# Altium project novena_pvt2.PrjPcb (part 4 of 4)

## Sheet 15fpga.SchDoc
size C
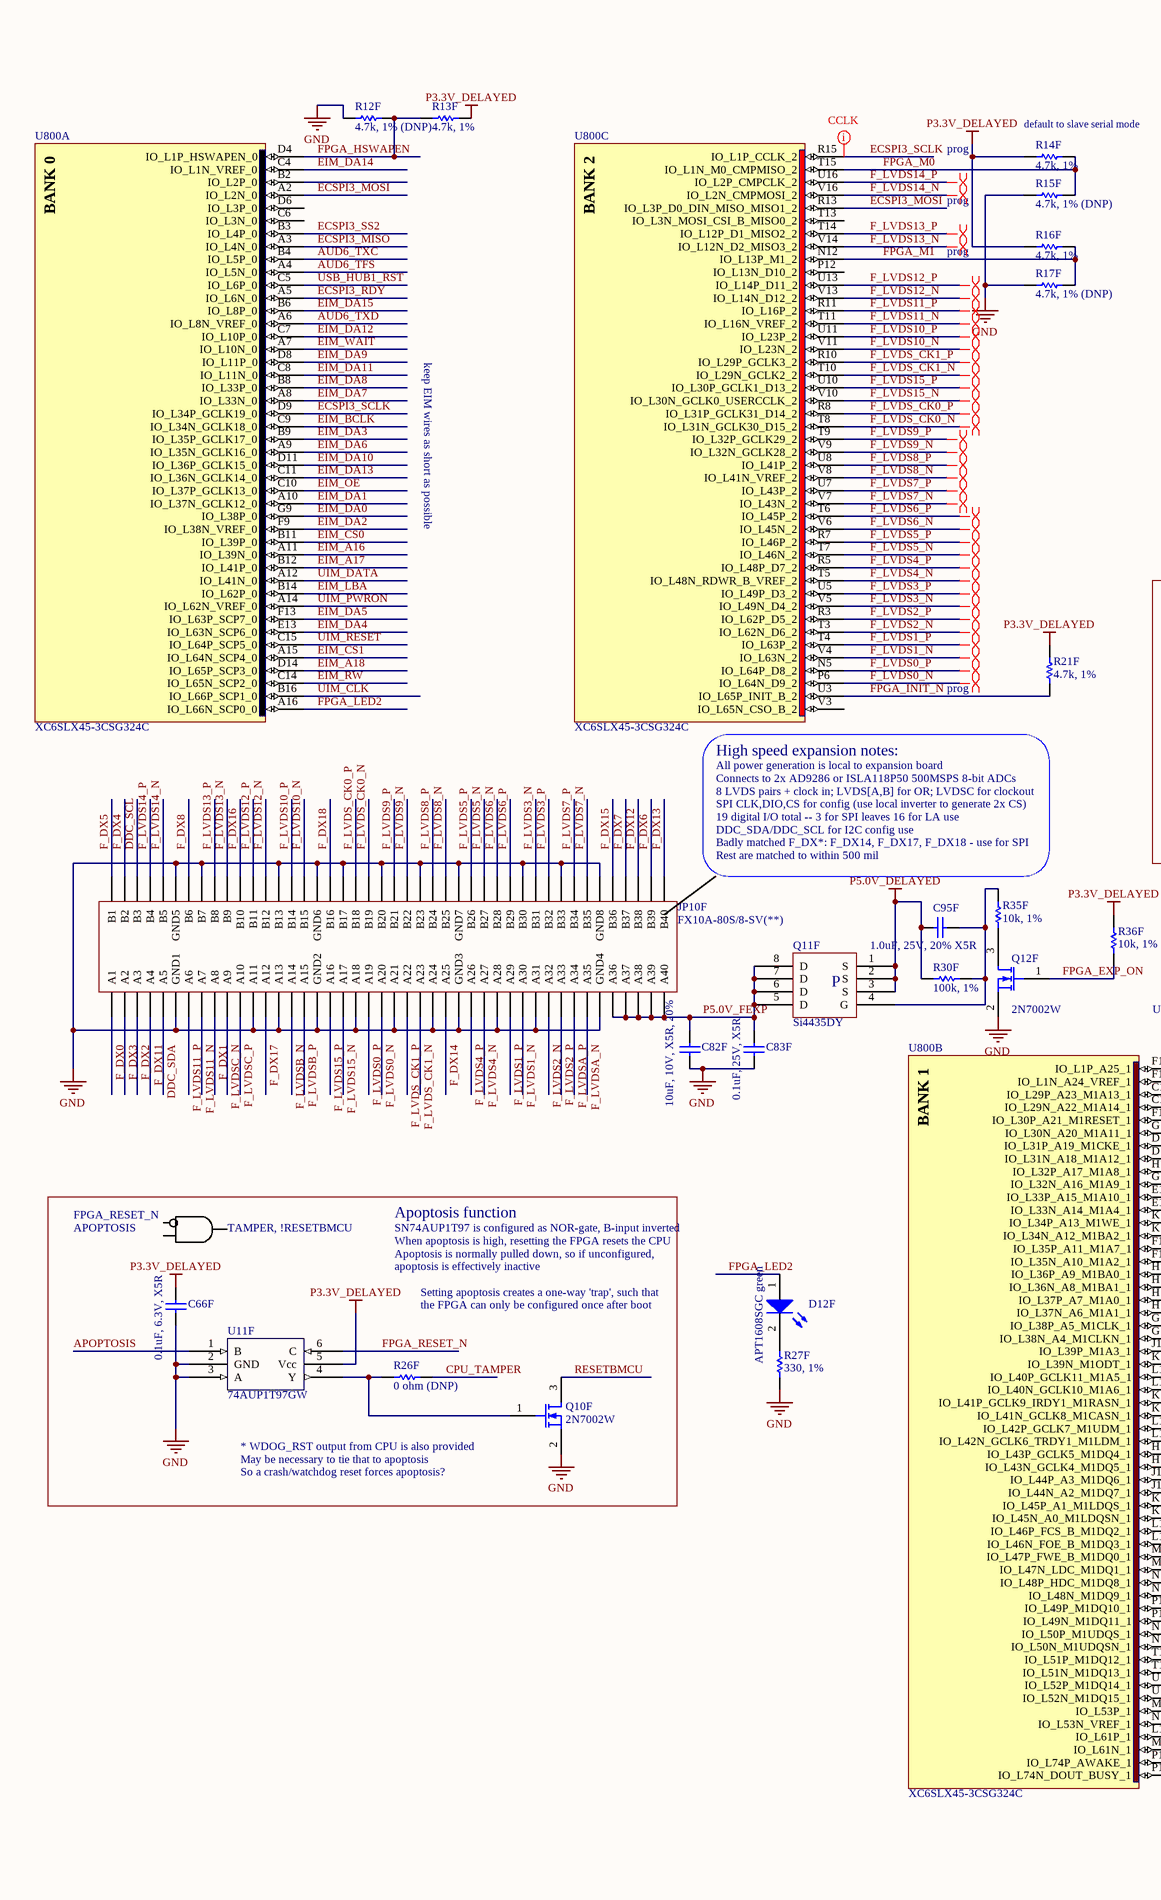
[diagram p16: 15fpga.SchDoc, left]
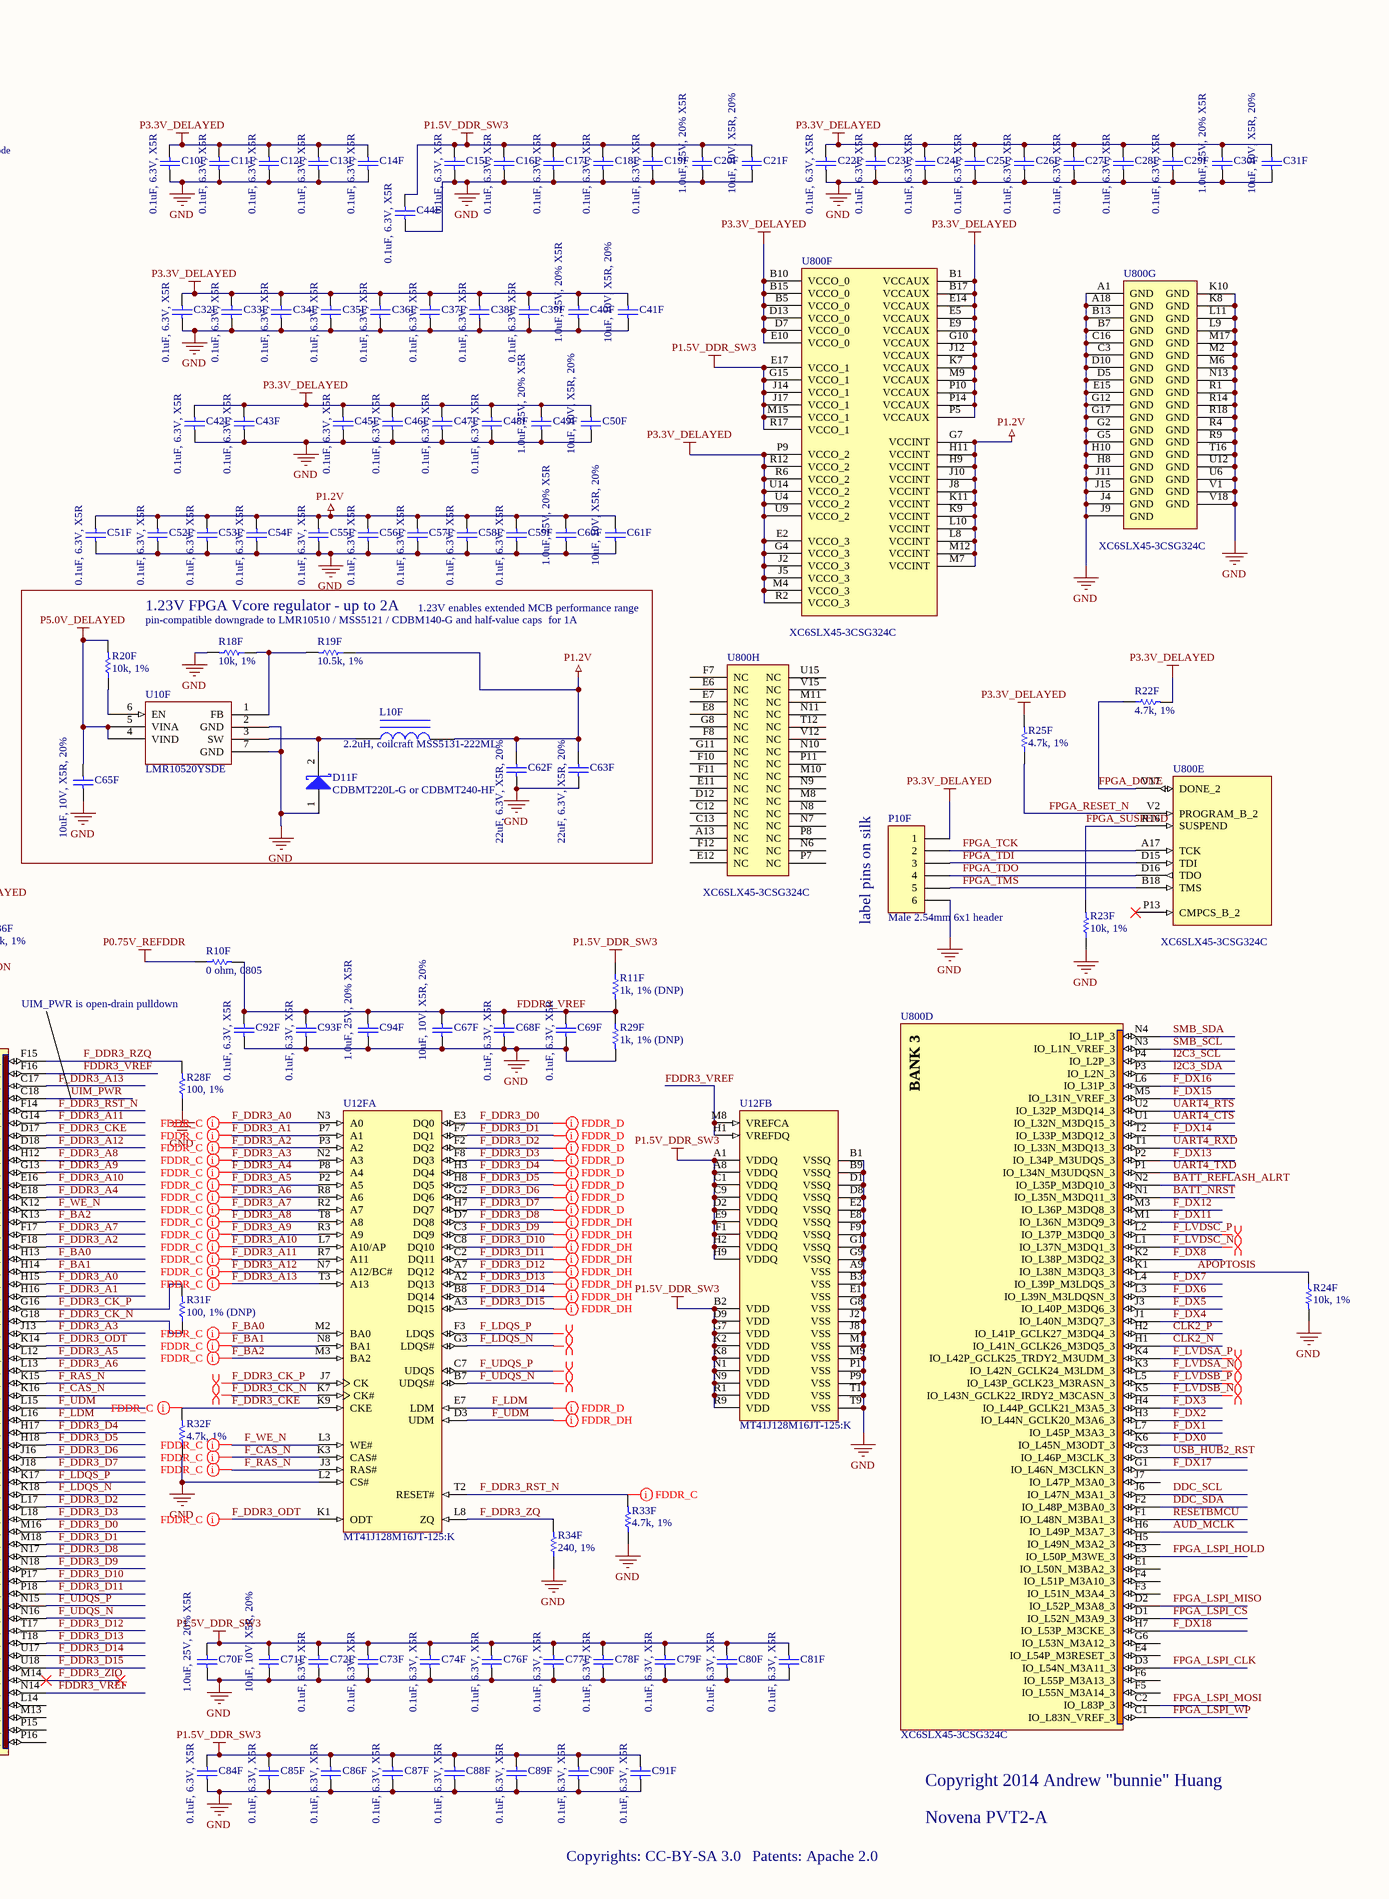
[diagram p17: 15fpga.SchDoc, right]

### Parts
C10F  0.1uF, 6.3V, X5R  [CAPC0603N_B]
C11F  0.1uF, 6.3V, X5R  [CAPC0603N_B]
C12F  0.1uF, 6.3V, X5R  [CAPC0603N_B]
C13F  0.1uF, 6.3V, X5R  [CAPC0603N_B]
C14F  0.1uF, 6.3V, X5R  [CAPC0603N_B]
C15F  0.1uF, 6.3V, X5R  [CAPC0603N_B]
C16F  0.1uF, 6.3V, X5R  [CAPC0603N_B]
C17F  0.1uF, 6.3V, X5R  [CAPC0603N_B]
C18F  0.1uF, 6.3V, X5R  [CAPC0603N_B]
C19F  0.1uF, 6.3V, X5R  [CAPC0603N_B]
C20F  1.0uF, 25V, 20% X5R  [CAPC1608N]
C21F  10uF, 10V, X5R, 20%  [CAPC1608N]
C22F  0.1uF, 6.3V, X5R  [CAPC0603N_B]
C23F  0.1uF, 6.3V, X5R  [CAPC0603N_B]
C24F  0.1uF, 6.3V, X5R  [CAPC0603N_B]
C25F  0.1uF, 6.3V, X5R  [CAPC0603N_B]
C26F  0.1uF, 6.3V, X5R  [CAPC0603N_B]
C27F  0.1uF, 6.3V, X5R  [CAPC0603N_B]
C28F  0.1uF, 6.3V, X5R  [CAPC0603N_B]
C29F  0.1uF, 6.3V, X5R  [CAPC0603N_B]
C30F  1.0uF, 25V, 20% X5R  [CAPC1608N]
C31F  10uF, 10V, X5R, 20%  [CAPC1608N]
C32F  0.1uF, 6.3V, X5R  [CAPC0603N_B]
C33F  0.1uF, 6.3V, X5R  [CAPC0603N_B]
C34F  0.1uF, 6.3V, X5R  [CAPC0603N_B]
C35F  0.1uF, 6.3V, X5R  [CAPC0603N_B]
C36F  0.1uF, 6.3V, X5R  [CAPC0603N_B]
C37F  0.1uF, 6.3V, X5R  [CAPC0603N_B]
C38F  0.1uF, 6.3V, X5R  [CAPC0603N_B]
C39F  0.1uF, 6.3V, X5R  [CAPC0603N_B]
C40F  1.0uF, 25V, 20% X5R  [CAPC1608N]
C41F  10uF, 10V, X5R, 20%  [CAPC1608N]
C42F  0.1uF, 6.3V, X5R  [CAPC0603N_B]
C43F  0.1uF, 6.3V, X5R  [CAPC0603N_B]
C44F  0.1uF, 6.3V, X5R  [CAPC0603N_B]
C45F  0.1uF, 6.3V, X5R  [CAPC0603N_B]
C46F  0.1uF, 6.3V, X5R  [CAPC0603N_B]
C47F  0.1uF, 6.3V, X5R  [CAPC0603N_B]
C48F  0.1uF, 6.3V, X5R  [CAPC0603N_B]
C49F  1.0uF, 25V, 20% X5R  [CAPC1608N]
C50F  10uF, 10V, X5R, 20%  [CAPC1608N]
C51F  0.1uF, 6.3V, X5R  [CAPC0603N_B]
C52F  0.1uF, 6.3V, X5R  [CAPC0603N_B]
C53F  0.1uF, 6.3V, X5R  [CAPC0603N_B]
C54F  0.1uF, 6.3V, X5R  [CAPC0603N_B]
C55F  0.1uF, 6.3V, X5R  [CAPC0603N_B]
C56F  0.1uF, 6.3V, X5R  [CAPC0603N_B]
C57F  0.1uF, 6.3V, X5R  [CAPC0603N_B]
C58F  0.1uF, 6.3V, X5R  [CAPC0603N_B]
C59F  0.1uF, 6.3V, X5R  [CAPC0603N_B]
C60F  1.0uF, 25V, 20% X5R  [CAPC1608N]
C61F  10uF, 10V, X5R, 20%  [CAPC1608N]
C62F  22uF, 6.3V, X5R, 20%  [CAPC1608N_HD]
C63F  22uF, 6.3V, X5R, 20%  [CAPC1608N_HD]
C65F  10uF, 10V, X5R, 20%  [CAPC1608N]
C66F  0.1uF, 6.3V, X5R  [CAPC0603N_B]
C67F  10uF, 10V, X5R, 20%  [CAPC1608N]
C68F  0.1uF, 6.3V, X5R  [CAPC0603N_B]
C69F  0.1uF, 6.3V, X5R  [CAPC0603N_B]
C70F  1.0uF, 25V, 20% X5R  [CAPC1608N]
C71F  10uF, 10V, X5R, 20%  [CAPC1608N]
C72F  0.1uF, 6.3V, X5R  [CAPC0603N_B]
C73F  0.1uF, 6.3V, X5R  [CAPC0603N_B]
C74F  0.1uF, 6.3V, X5R  [CAPC0603N_B]
C76F  0.1uF, 6.3V, X5R  [CAPC0603N_B]
C77F  0.1uF, 6.3V, X5R  [CAPC0603N_B]
C78F  0.1uF, 6.3V, X5R  [CAPC0603N_B]
C79F  0.1uF, 6.3V, X5R  [CAPC0603N_B]
C80F  0.1uF, 6.3V, X5R  [CAPC0603N_B]
C81F  0.1uF, 6.3V, X5R  [CAPC0603N_B]
C82F  10uF, 10V, X5R, 20%  [CAPC1608N]
C83F  0.1uF, 25V, X5R  [CAPC1005N]
C84F  0.1uF, 6.3V, X5R  [CAPC0603N_B]
C85F  0.1uF, 6.3V, X5R  [CAPC0603N_B]
C86F  0.1uF, 6.3V, X5R  [CAPC0603N_B]
C87F  0.1uF, 6.3V, X5R  [CAPC0603N_B]
C88F  0.1uF, 6.3V, X5R  [CAPC0603N_B]
C89F  0.1uF, 6.3V, X5R  [CAPC0603N_B]
C90F  0.1uF, 6.3V, X5R  [CAPC0603N_B]
C91F  0.1uF, 6.3V, X5R  [CAPC0603N_B]
C92F  0.1uF, 6.3V, X5R  [CAPC0603N_B]
C93F  0.1uF, 6.3V, X5R  [CAPC0603N_B]
C94F  1.0uF, 25V, 20% X5R  [CAPC1608N]
C95F  1.0uF, 25V, 20% X5R  [CAPC1608N]
D11F  CDBMT220L-G or CDBMT240-HF  [SOD123]
D12F  APT1608SGC green  [CD1608-0603]
JP10F  FX10A-80S/8-SV(**)  [HRS_FX10A-80S/8-SV1(**)]
L10F  2.2uH, coilcraft MSS5131-222ML  [COILCRAFT_MSS5121]
P10F  Male 2.54mm 6x1 header  [HDR1X6]
Q10F  2N7002W  [SOT323-3AN]
Q11F  Si4435DY  [SOIC127P600-8AN]
Q12F  2N7002W  [SOT323-3AN]
R10F  0 ohm, 0805  [RESC2012N]
R11F  1k, 1% (DNP)  [RESC1005N]
R12F  4.7k, 1% (DNP)  [RESC1005N]
R13F  4.7k, 1%  [RESC1005N]
R14F  4.7k, 1%  [RESC1005N]
R15F  4.7k, 1% (DNP)  [RESC1005N]
R16F  4.7k, 1%  [RESC1005N]
R17F  4.7k, 1% (DNP)  [RESC1005N]
R18F  10k, 1%  [RESC1005N]
R19F  10.5k, 1%  [RESC1005N]
R20F  10k, 1%  [RESC1005N]
R21F  4.7k, 1%  [RESC1005N]
R22F  4.7k, 1%  [RESC1005N]
R23F  10k, 1%  [RESC1005N]
R24F  10k, 1%  [RESC1005N]
R25F  4.7k, 1%  [RESC1005N]
R26F  0 ohm (DNP)  [RESC1005N]
R27F  330, 1%  [RESC1005N]
R28F  100, 1%  [RESC1005N]
R29F  1k, 1% (DNP)  [RESC1005N]
R30F  100k, 1%  [RESC1005N]
R31F  100, 1% (DNP)  [RESC1005N]
R32F  4.7k, 1%  [RESC1005N]
R33F  4.7k, 1%  [RESC1005N]
R34F  240, 1%  [RESC1005N]
R35F  10k, 1%  [RESC1005N]
R36F  10k, 1%  [RESC1005N]
U10F  LMR10520YSDE  [SON95P300X300X80-7V]
U11F  74AUP1T97GW  [SOT363-6N]
U12F  MT41J128M16JT-125:K  [MICT-HA-96]  (parts A,B of 3)
U800  XC6SLX45-3CSG324C  [CSG324]  (parts A,B,C,D,E,F,G,H of 8)

### Blocks framed on the sheet
1.23V FPGA Vcore regulator - up to 2A: C62F C63F C65F D11F L10F R18F R19F R20F U10F
Apoptosis function: C66F Q10F R26F U11F

### Nets
GND: C10F.2 C11F.2 C12F.2 C13F.2 C14F.2 C15F.2 C16F.2 C17F.2 C18F.2 C19F.2 C20F.1 C21F.2 C22F.2 C23F.2 C24F.2 C25F.2 C26F.2 C27F.2 C28F.2 C29F.2 C30F.1 C31F.2 C32F.2 C33F.2 C34F.2 C35F.2 C36F.2 C37F.2 C38F.2 C39F.2 C40F.1 C41F.2 C42F.2 C43F.2 C44F.2 C45F.2 C46F.2 C47F.2 C48F.2 C49F.1 C50F.2 C51F.2 C52F.2 C53F.2 C54F.2 C55F.2 C56F.2 C57F.2 C58F.2 C59F.2 C60F.1 C61F.2 C62F.2 C63F.2 C65F.1 C66F.2 C67F.2 C68F.2 C69F.2 C70F.1 C71F.2 C72F.2 C73F.2 C74F.2 C76F.2 C77F.2 C78F.2 C79F.2 C80F.2 C81F.2 C82F.1 C83F.2 C84F.2 C85F.2 C86F.2 C87F.2 C88F.2 C89F.2 C90F.2 C91F.2 C92F.2 C93F.2 C94F.1 D11F.1(A) JP10F.A11 JP10F.A13 JP10F.A18 JP10F.A21 JP10F.A24 JP10F.A28 JP10F.A31 JP10F.B7 JP10F.B13 JP10F.B17 JP10F.B20 JP10F.B23 JP10F.B30 JP10F.B33 JP10F.GND1 JP10F.GND2 JP10F.GND3 JP10F.GND4 JP10F.GND5 JP10F.GND6 JP10F.GND7 JP10F.GND8 P10F.6 Q10F.2(S) Q12F.2(S) R12F.1 R15F.1 R17F.1 R18F.2 R23F.1 R24F.2 R27F.1 R28F.1 R29F.2 R32F.1 R33F.1 R34F.1 U10F.2(GND) U10F.7(GND) U11F.2(GND) U11F.3(A) U12F.A9(VSS) U12F.B1(VSSQ) U12F.B3(VSS) U12F.B9(VSSQ) U12F.D1(VSSQ) U12F.D8(VSSQ) U12F.E1(VSS) U12F.E2(VSSQ) U12F.E8(VSSQ) U12F.F9(VSSQ) U12F.G1(VSSQ) U12F.G8(VSS) U12F.G9(VSSQ) U12F.J2(VSS) U12F.J8(VSS) U12F.L2(CS#) U12F.M1(VSS) U12F.M9(VSS) U12F.P1(VSS) U12F.P9(VSS) U12F.T1(VSS) U12F.T9(VSS) U800.A1(GND) U800.A18(GND) U800.B7(GND) U800.B13(GND) U800.C3(GND) U800.C16(GND) U800.D5(GND) U800.D10(GND) U800.E15(GND) U800.G2(GND) U800.G5(GND) U800.G12(GND) U800.G17(GND) U800.H8(GND) U800.H10(GND) U800.J4(GND) U800.J9(GND) U800.J11(GND) U800.J15(GND) U800.K8(GND) U800.K10(GND) U800.L9(GND) U800.L11(GND) U800.M2(GND) U800.M6(GND) U800.M17(GND) U800.N13(GND) U800.R1(GND) U800.R4(GND) U800.R9(GND) U800.R14(GND) U800.R18(GND) U800.T16(GND) U800.U6(GND) U800.U12(GND) U800.V1(GND) U800.V18(GND)
P0.75V_REFDDR: R10F.1
P1.2V: C51F.1 C52F.1 C53F.1 C54F.1 C55F.1 C56F.1 C57F.1 C58F.1 C59F.1 C60F.2 C61F.1 C62F.1 C63F.1 L10F.2 R19F.1 U800.G7(VCCINT) U800.H9(VCCINT) U800.H11(VCCINT) U800.J8(VCCINT) U800.J10(VCCINT) U800.K9(VCCINT) U800.K11(VCCINT) U800.L8(VCCINT) U800.L10(VCCINT) U800.M7(VCCINT) U800.M12(VCCINT)
P1.5V_DDR_SW3: C15F.1 C16F.1 C17F.1 C18F.1 C19F.1 C20F.2 C21F.1 C44F.1 C70F.2 C71F.1 C72F.1 C73F.1 C74F.1 C76F.1 C77F.1 C78F.1 C79F.1 C80F.1 C81F.1 C84F.1 C85F.1 C86F.1 C87F.1 C88F.1 C89F.1 C90F.1 C91F.1 R11F.1 U12F.A1(VDDQ) U12F.A8(VDDQ) U12F.B2(VDD) U12F.C1(VDDQ) U12F.C9(VDDQ) U12F.D2(VDDQ) U12F.D9(VDD) U12F.E9(VDDQ) U12F.F1(VDDQ) U12F.G7(VDD) U12F.H2(VDDQ) U12F.H9(VDDQ) U12F.K2(VDD) U12F.K8(VDD) U12F.N1(VDD) U12F.N9(VDD) U12F.R1(VDD) U12F.R9(VDD) U800.E17(VCCO_1) U800.G15(VCCO_1) U800.J14(VCCO_1) U800.J17(VCCO_1) U800.M15(VCCO_1) U800.R17(VCCO_1)
P3.3V_DELAYED: C10F.1 C11F.1 C12F.1 C13F.1 C14F.1 C22F.1 C23F.1 C24F.1 C25F.1 C26F.1 C27F.1 C28F.1 C29F.1 C30F.2 C31F.1 C32F.1 C33F.1 C34F.1 C35F.1 C36F.1 C37F.1 C38F.1 C39F.1 C40F.2 C41F.1 C42F.1 C43F.1 C45F.1 C46F.1 C47F.1 C48F.1 C49F.2 C50F.1 C66F.1 P10F.1 R13F.2 R14F.1 R16F.1 R21F.1 R22F.2 R25F.2 R36F.1 U11F.5(Vcc) U800.B1(VCCAUX) U800.B5(VCCO_0) U800.B10(VCCO_0) U800.B15(VCCO_0) U800.B17(VCCAUX) U800.D7(VCCO_0) U800.D13(VCCO_0) U800.E2(VCCO_3) U800.E5(VCCAUX) U800.E9(VCCAUX) U800.E10(VCCO_0) U800.E14(VCCAUX) U800.G4(VCCO_3) U800.G10(VCCAUX) U800.J2(VCCO_3) U800.J5(VCCO_3) U800.J12(VCCAUX) U800.K7(VCCAUX) U800.M4(VCCO_3) U800.M9(VCCAUX) U800.P5(VCCAUX) U800.P9(VCCO_2) U800.P10(VCCAUX) U800.P14(VCCAUX) U800.R2(VCCO_3) U800.R6(VCCO_2) U800.R12(VCCO_2) U800.U4(VCCO_2) U800.U9(VCCO_2) U800.U14(VCCO_2)
P5.0V_DELAYED: C65F.2 C95F.1 Q11F.1(S) Q11F.2(S) Q11F.3(S) R20F.2 R30F.2 U10F.4(VIND) U10F.5(VINA)
APOPTOSIS: R24F.1 U11F.1(B) U800.K1(IO_L38N_M3DQ3_3)
AUD6_TFS: U800.A4(IO_L5N_0)
AUD6_TXC: U800.B4(IO_L5P_0)
AUD6_TXD: U800.A6(IO_L8N_VREF_0)
AUD_MCLK: U800.H6(IO_L49P_M3A7_3)
BATT_NRST: U800.N1(IO_L35N_M3DQ11_3)
BATT_REFLASH_ALRT: U800.N2(IO_L35P_M3DQ10_3)
CLK2_N: U800.H1(IO_L41N_GCLK26_M3DQ5_3)
CLK2_P: U800.H2(IO_L41P_GCLK27_M3DQ4_3)
CPU_TAMPER: R26F.2
DDC_SCL: JP10F.B3 U800.J6(IO_L47N_M3A1_3)
DDC_SDA: JP10F.A5 U800.F2(IO_L48P_M3BA0_3)
ECSPI3_MISO: U800.A3(IO_L4N_0)
ECSPI3_MOSI: U800.A2(IO_L2N_0) U800.R13(IO_L3P_D0_DIN_MISO_MISO1_2)
ECSPI3_RDY: U800.A5(IO_L6N_0)
ECSPI3_SCLK: U800.D9(IO_L34P_GCLK19_0) U800.R15(IO_L1P_CCLK_2)
ECSPI3_SS2: U800.B3(IO_L4P_0)
EIM_A16: U800.A11(IO_L39N_0)
EIM_A17: U800.B12(IO_L41P_0)
EIM_A18: U800.D14(IO_L65P_SCP3_0)
EIM_BCLK: U800.C9(IO_L34N_GCLK18_0)
EIM_CS0: U800.B11(IO_L39P_0)
EIM_CS1: U800.A15(IO_L64N_SCP4_0)
EIM_DA0: U800.G9(IO_L38P_0)
EIM_DA1: U800.A10(IO_L37N_GCLK12_0)
EIM_DA2: U800.F9(IO_L38N_VREF_0)
EIM_DA3: U800.B9(IO_L35P_GCLK17_0)
EIM_DA4: U800.E13(IO_L63N_SCP6_0)
EIM_DA5: U800.F13(IO_L63P_SCP7_0)
EIM_DA6: U800.A9(IO_L35N_GCLK16_0)
EIM_DA7: U800.A8(IO_L33N_0)
EIM_DA8: U800.B8(IO_L33P_0)
EIM_DA9: U800.D8(IO_L11P_0)
EIM_DA10: U800.D11(IO_L36P_GCLK15_0)
EIM_DA11: U800.C8(IO_L11N_0)
EIM_DA12: U800.C7(IO_L10P_0)
EIM_DA13: U800.C11(IO_L36N_GCLK14_0)
EIM_DA14: U800.C4(IO_L1N_VREF_0)
EIM_DA15: U800.B6(IO_L8P_0)
EIM_LBA: U800.B14(IO_L62P_0)
EIM_OE: U800.C10(IO_L37P_GCLK13_0)
EIM_RW: U800.C14(IO_L65N_SCP2_0)
EIM_WAIT: U800.A7(IO_L10N_0)
F_BA0: U12F.M2(BA0) U800.H13(IO_L36P_A9_M1BA0_1)
F_BA1: U12F.N8(BA1) U800.H14(IO_L36N_A8_M1BA1_1)
F_BA2: U12F.M3(BA2) U800.K13(IO_L34N_A12_M1BA2_1)
F_CAS_N: U12F.K3(CAS#) U800.K16(IO_L41N_GCLK8_M1CASN_1)
F_DDR3_A0: U12F.N3(A0) U800.H15(IO_L37P_A7_M1A0_1)
F_DDR3_A1: U12F.P7(A1) U800.H16(IO_L37N_A6_M1A1_1)
F_DDR3_A2: U12F.P3(A2) U800.F18(IO_L35N_A10_M1A2_1)
F_DDR3_A3: U12F.N2(A3) U800.J13(IO_L39P_M1A3_1)
F_DDR3_A4: U12F.P8(A4) U800.E18(IO_L33N_A14_M1A4_1)
F_DDR3_A5: U12F.P2(A5) U800.L12(IO_L40P_GCLK11_M1A5_1)
F_DDR3_A6: U12F.R8(A6) U800.L13(IO_L40N_GCLK10_M1A6_1)
F_DDR3_A7: U12F.R2(A7) U800.F17(IO_L35P_A11_M1A7_1)
F_DDR3_A8: U12F.T8(A8) U800.H12(IO_L32P_A17_M1A8_1)
F_DDR3_A9: U12F.R3(A9) U800.G13(IO_L32N_A16_M1A9_1)
F_DDR3_A10: U12F.L7(A10/AP) U800.E16(IO_L33P_A15_M1A10_1)
F_DDR3_A11: U12F.R7(A11) U800.G14(IO_L30N_A20_M1A11_1)
F_DDR3_A12: U12F.N7(A12/BC#) U800.D18(IO_L31N_A18_M1A12_1)
F_DDR3_A13: U12F.T3(A13) U800.C17(IO_L29P_A23_M1A13_1)
F_DDR3_CK_N: R31F.1 U12F.K7(CK#) U800.G18(IO_L38N_A4_M1CLKN_1)
F_DDR3_CK_P: R31F.2 U12F.J7(CK) U800.G16(IO_L38P_A5_M1CLK_1)
F_DDR3_CKE: R32F.2 U12F.K9(CKE) U800.D17(IO_L31P_A19_M1CKE_1)
F_DDR3_D0: U12F.E3(DQ0) U800.M16(IO_L47P_FWE_B_M1DQ0_1)
F_DDR3_D1: U12F.F7(DQ1) U800.M18(IO_L47N_LDC_M1DQ1_1)
F_DDR3_D2: U12F.F2(DQ2) U800.L17(IO_L46P_FCS_B_M1DQ2_1)
F_DDR3_D3: U12F.F8(DQ3) U800.L18(IO_L46N_FOE_B_M1DQ3_1)
F_DDR3_D4: U12F.H3(DQ4) U800.H17(IO_L43P_GCLK5_M1DQ4_1)
F_DDR3_D5: U12F.H8(DQ5) U800.H18(IO_L43N_GCLK4_M1DQ5_1)
F_DDR3_D6: U12F.G2(DQ6) U800.J16(IO_L44P_A3_M1DQ6_1)
F_DDR3_D7: U12F.H7(DQ7) U800.J18(IO_L44N_A2_M1DQ7_1)
F_DDR3_D8: U12F.D7(DQ8) U800.N17(IO_L48P_HDC_M1DQ8_1)
F_DDR3_D9: U12F.C3(DQ9) U800.N18(IO_L48N_M1DQ9_1)
F_DDR3_D10: U12F.C8(DQ10) U800.P17(IO_L49P_M1DQ10_1)
F_DDR3_D11: U12F.C2(DQ11) U800.P18(IO_L49N_M1DQ11_1)
F_DDR3_D12: U12F.A7(DQ12) U800.T17(IO_L51P_M1DQ12_1)
F_DDR3_D13: U12F.A2(DQ13) U800.T18(IO_L51N_M1DQ13_1)
F_DDR3_D14: U12F.B8(DQ14) U800.U17(IO_L52P_M1DQ14_1)
F_DDR3_D15: U12F.A3(DQ15) U800.U18(IO_L52N_M1DQ15_1)
F_DDR3_ODT: U12F.K1(ODT) U800.K14(IO_L39N_M1ODT_1)
F_DDR3_RST_N: R33F.2 U12F.T2(RESET#) U800.F14(IO_L30P_A21_M1RESET_1)
F_DDR3_RZQ: R28F.2 U800.F15(IO_L1P_A25_1)
F_DDR3_ZIO: U800.M14(IO_L53P_1)
F_DDR3_ZQ: R34F.2 U12F.L8(ZQ)
F_DX0: JP10F.A1 U800.K6(IO_L45N_M3ODT_3)
F_DX1: JP10F.A8 U800.L7(IO_L45P_M3A3_3)
F_DX2: JP10F.A3 U800.H3(IO_L44N_GCLK20_M3A6_3)
F_DX3: JP10F.A2 U800.H4(IO_L44P_GCLK21_M3A5_3)
F_DX4: JP10F.B2 U800.J1(IO_L40N_M3DQ7_3)
F_DX5: JP10F.B1 U800.J3(IO_L40P_M3DQ6_3)
F_DX6: JP10F.B39 U800.L3(IO_L39N_M3LDQSN_3)
F_DX7: JP10F.B37 U800.L4(IO_L39P_M3LDQS_3)
F_DX8: JP10F.B6 U800.K2(IO_L38P_M3DQ2_3)
F_DX11: JP10F.A4 U800.M1(IO_L36N_M3DQ9_3)
F_DX12: JP10F.B38 U800.M3(IO_L36P_M3DQ8_3)
F_DX13: JP10F.B40 U800.P2(IO_L34P_M3UDQS_3)
F_DX14: JP10F.A25 U800.T2(IO_L33P_M3DQ12_3)
F_DX15: JP10F.B36 U800.M5(IO_L31N_VREF_3)
F_DX16: JP10F.B10 U800.L6(IO_L31P_3)
F_DX17: JP10F.A12 U800.G1(IO_L46N_M3CLKN_3)
F_DX18: JP10F.B16 U800.H7(IO_L53P_M3CKE_3)
F_LDM: U12F.E7(LDM) U800.L16(IO_L42N_GCLK6_TRDY1_M1LDM_1)
F_LDQS_N: U12F.G3(LDQS#) U800.K18(IO_L45N_A0_M1LDQSN_1)
F_LDQS_P: U12F.F3(LDQS) U800.K17(IO_L45P_A1_M1LDQS_1)
F_LVDS0_N: JP10F.A20 U800.P6(IO_L64N_D9_2)
F_LVDS0_P: JP10F.A19 U800.N5(IO_L64P_D8_2)
F_LVDS1_N: JP10F.A30 U800.V4(IO_L63N_2)
F_LVDS1_P: JP10F.A29 U800.T4(IO_L63P_2)
F_LVDS2_N: JP10F.A32 U800.T3(IO_L62N_D6_2)
F_LVDS2_P: JP10F.A33 U800.R3(IO_L62P_D5_2)
F_LVDS3_N: JP10F.B31 U800.V5(IO_L49N_D4_2)
F_LVDS3_P: JP10F.B32 U800.U5(IO_L49P_D3_2)
F_LVDS4_N: JP10F.A27 U800.T5(IO_L48N_RDWR_B_VREF_2)
F_LVDS4_P: JP10F.A26 U800.R5(IO_L48P_D7_2)
F_LVDS5_N: JP10F.B27 U800.T7(IO_L46N_2)
F_LVDS5_P: JP10F.B26 U800.R7(IO_L46P_2)
F_LVDS6_N: JP10F.B28 U800.V6(IO_L45N_2)
F_LVDS6_P: JP10F.B29 U800.T6(IO_L45P_2)
F_LVDS7_N: JP10F.B35 U800.V7(IO_L43N_2)
F_LVDS7_P: JP10F.B34 U800.U7(IO_L43P_2)
F_LVDS8_N: JP10F.B25 U800.V8(IO_L41N_VREF_2)
F_LVDS8_P: JP10F.B24 U800.U8(IO_L41P_2)
F_LVDS9_N: JP10F.B22 U800.V9(IO_L32N_GCLK28_2)
F_LVDS9_P: JP10F.B21 U800.T9(IO_L32P_GCLK29_2)
F_LVDS10_N: JP10F.B15 U800.V11(IO_L23N_2)
F_LVDS10_P: JP10F.B14 U800.U11(IO_L23P_2)
F_LVDS11_N: JP10F.A7 U800.T11(IO_L16N_VREF_2)
F_LVDS11_P: JP10F.A6 U800.R11(IO_L16P_2)
F_LVDS12_N: JP10F.B12 U800.V13(IO_L14N_D12_2)
F_LVDS12_P: JP10F.B11 U800.U13(IO_L14P_D11_2)
F_LVDS13_N: JP10F.B9 U800.V14(IO_L12N_D2_MISO3_2)
F_LVDS13_P: JP10F.B8 U800.T14(IO_L12P_D1_MISO2_2)
F_LVDS14_N: JP10F.B5 U800.V16(IO_L2N_CMPMOSI_2)
F_LVDS14_P: JP10F.B4 U800.U16(IO_L2P_CMPCLK_2)
F_LVDS15_N: JP10F.A17 U800.V10(IO_L30N_GCLK0_USERCCLK_2)
F_LVDS15_P: JP10F.A16 U800.U10(IO_L30P_GCLK1_D13_2)
F_LVDS_CK0_N: JP10F.B19 U800.T8(IO_L31N_GCLK30_D15_2)
F_LVDS_CK0_P: JP10F.B18 U800.R8(IO_L31P_GCLK31_D14_2)
F_LVDS_CK1_N: JP10F.A23 U800.T10(IO_L29N_GCLK2_2)
F_LVDS_CK1_P: JP10F.A22 U800.R10(IO_L29P_GCLK3_2)
F_LVDSA_N: JP10F.A35 U800.K3(IO_L42N_GCLK24_M3LDM_3)
F_LVDSA_P: JP10F.A34 U800.K4(IO_L42P_GCLK25_TRDY2_M3UDM_3)
F_LVDSB_N: JP10F.A14 U800.K5(IO_L43N_GCLK22_IRDY2_M3CASN_3)
F_LVDSB_P: JP10F.A15 U800.L5(IO_L43P_GCLK23_M3RASN_3)
F_LVDSC_N: JP10F.A9 U800.L1(IO_L37N_M3DQ1_3)
F_LVDSC_P: JP10F.A10 U800.L2(IO_L37P_M3DQ0_3)
F_RAS_N: U12F.J3(RAS#) U800.K15(IO_L41P_GCLK9_IRDY1_M1RASN_1)
F_UDM: U12F.D3(UDM) U800.L15(IO_L42P_GCLK7_M1UDM_1)
F_UDQS_N: U12F.B7(UDQS#) U800.N16(IO_L50N_M1UDQSN_1)
F_UDQS_P: U12F.C7(UDQS) U800.N15(IO_L50P_M1UDQS_1)
F_WE_N: U12F.L3(WE#) U800.K12(IO_L34P_A13_M1WE_1)
FDDR3_VREF: C67F.1 C68F.1 C69F.1 C92F.1 C93F.1 C94F.2 R10F.2 R11F.2 R29F.1 U12F.H1(VREFDQ) U12F.M8(VREFCA) U800.F16(IO_L1N_A24_VREF_1) U800.N14(IO_L53N_VREF_1)
FPGA_DONE: R22F.1 U800.V17(DONE_2)
FPGA_EXP_ON: Q12F.1(G) R36F.2
FPGA_HSWAPEN: R12F.2 R13F.1 U800.D4(IO_L1P_HSWAPEN_0)
FPGA_INIT_N: R21F.2 U800.U3(IO_L65P_INIT_B_2)
FPGA_LED2: D12F.1(A) U800.A16(IO_L66N_SCP0_0)
FPGA_LSPI_CLK: U800.D3(IO_L54N_M3A11_3)
FPGA_LSPI_CS: U800.D1(IO_L52N_M3A9_3)
FPGA_LSPI_HOLD: U800.E3(IO_L50P_M3WE_3)
FPGA_LSPI_MISO: U800.D2(IO_L52P_M3A8_3)
FPGA_LSPI_MOSI: U800.C2(IO_L83P_3)
FPGA_LSPI_WP: U800.C1(IO_L83N_VREF_3)
FPGA_M0: R14F.2 R15F.2 U800.T15(IO_L1N_M0_CMPMISO_2)
FPGA_M1: R16F.2 R17F.2 U800.N12(IO_L13P_M1_2)
FPGA_RESET_N: R25F.1 U11F.6(C) U800.V2(PROGRAM_B_2)
FPGA_SUSPEND: R23F.2 U800.R16(SUSPEND)
FPGA_TCK: P10F.2 U800.A17(TCK)
FPGA_TDI: P10F.3 U800.D15(TDI)
FPGA_TDO: P10F.4 U800.D16(TDO)
FPGA_TMS: P10F.5 U800.B18(TMS)
I2C3_SCL: U800.P4(IO_L2P_3)
I2C3_SDA: U800.P3(IO_L2N_3)
P5.0V_FEXP: C82F.2 C83F.1 JP10F.A36 JP10F.A37 JP10F.A38 JP10F.A39 JP10F.A40 Q11F.5(D) Q11F.6(D) Q11F.7(D) Q11F.8(D)
RESETBMCU: Q10F.3(D) U800.F1(IO_L48N_M3BA1_3)
SMB_SCL: U800.N3(IO_L1N_VREF_3)
SMB_SDA: U800.N4(IO_L1P_3)
UART4_CTS: U800.U1(IO_L32N_M3DQ15_3)
UART4_RTS: U800.U2(IO_L32P_M3DQ14_3)
UART4_RXD: U800.T1(IO_L33N_M3DQ13_3)
UART4_TXD: U800.P1(IO_L34N_M3UDQSN_3)
UIM_CLK: U800.B16(IO_L66P_SCP1_0)
UIM_DATA: U800.A12(IO_L41N_0)
UIM_PWR: U800.C18(IO_L29N_A22_M1A14_1)
UIM_PWRON: U800.A14(IO_L62N_VREF_0)
UIM_RESET: U800.C15(IO_L64P_SCP5_0)
USB_HUB1_RST: U800.C5(IO_L6P_0)
USB_HUB2_RST: U800.G3(IO_L46P_M3CLK_3)
NetC95F_2: C95F.2 Q11F.4(G) R30F.1 R35F.1
NetD11F_2: D11F.2(K) L10F.1 U10F.3(SW)
NetD12F_2: D12F.2(K) R27F.2
NetQ10F_1: Q10F.1(G) R26F.1 U11F.4(Y)
NetQ12F_3: Q12F.3(D) R35F.2
NetR18F_1: R18F.1 R19F.2 U10F.1(FB)
NetR20F_1: R20F.1 U10F.6(EN)

Not connected (* = marked no-connect by the designer): U800 A13(NC) B2(IO_L2P_0) C6(IO_L3N_0) C12(NC) C13(NC) D6(IO_L3P_0) D12(NC) E1(IO_L50N_M3BA2_3) E4(IO_L54P_M3RESET_3) E6(NC) E7(NC) E8(NC) E11(NC) E12(NC) F3(IO_L51N_M3A4_3) F4(IO_L51P_M3A10_3) F5(IO_L55N_M3A14_3) F6(IO_L55P_M3A13_3) F7(NC) F8(NC) F10(NC) F11(NC) F12(NC) G6(IO_L53N_M3A12_3) G8(NC) G11(NC) H5(IO_L49N_M3A2_3) J7(IO_L47P_M3A0_3) L14(IO_L61P_1) M8(NC) M10(NC) M11(NC) M13(IO_L61N_1) N6(NC) N7(NC) N8(NC) N9(NC) N10(NC) N11(NC) P7(NC) P8(NC) P11(NC) P12(IO_L13N_D10_2) P13(CMPCS_B_2)* P15(IO_L74P_AWAKE_1) P16(IO_L74N_DOUT_BUSY_1) T12(NC) T13(IO_L3N_MOSI_CSI_B_MISO0_2) U15(NC) V3(IO_L65N_CSO_B_2) V12(NC) V15(NC)

### Layout directives
net class CCLK: ECSPI3_SCLK
differential pair: F_DDR3_CK_N, F_DDR3_CK_P, F_LDQS_N, F_LDQS_P, F_LVDS0_N, F_LVDS0_P, F_LVDS1_N, F_LVDS1_P, F_LVDS2_N, F_LVDS2_P, F_LVDS3_N, F_LVDS3_P, F_LVDS4_N, F_LVDS4_P, F_LVDS5_N, F_LVDS5_P, F_LVDS6_N, F_LVDS6_P, F_LVDS7_N, F_LVDS7_P, F_LVDS8_N, F_LVDS8_P, F_LVDS9_N, F_LVDS9_P, F_LVDS10_N, F_LVDS10_P, F_LVDS11_N, F_LVDS11_P, F_LVDS12_N, F_LVDS12_P, F_LVDS13_N, F_LVDS13_P, F_LVDS14_N, F_LVDS14_P, F_LVDS15_N, F_LVDS15_P, F_LVDS_CK0_N, F_LVDS_CK0_P, F_LVDS_CK1_N, F_LVDS_CK1_P, F_LVDSA_N, F_LVDSA_P, F_LVDSB_N, F_LVDSB_P, F_LVDSC_N, F_LVDSC_P, F_UDQS_N, F_UDQS_P
net class FDDR_D: F_DDR3_D0, F_DDR3_D1, F_DDR3_D2, F_DDR3_D3, F_DDR3_D4, F_DDR3_D5, F_DDR3_D6, F_DDR3_D7, F_LDM
net class FDDR_DH: F_DDR3_D8, F_DDR3_D9, F_DDR3_D10, F_DDR3_D11, F_DDR3_D12, F_DDR3_D13, F_DDR3_D14, F_DDR3_D15, F_UDM
net class FDDR_C: F_BA0, F_BA1, F_BA2, F_CAS_N, F_DDR3_A0, F_DDR3_A1, F_DDR3_A2, F_DDR3_A3, F_DDR3_A4, F_DDR3_A5, F_DDR3_A6, F_DDR3_A7, F_DDR3_A8, F_DDR3_A9, F_DDR3_A10, F_DDR3_A11, F_DDR3_A12, F_DDR3_A13, F_DDR3_CKE, F_DDR3_ODT, F_DDR3_RST_N, F_RAS_N, F_WE_N

### Notes on the sheet
- (near R14F) default to slave serial mode
- prog
- keep EIM wires as short as possible
- pin-compatible downgrade to LMR10510 / MSS5121 / CDBM140-G and half-value caps  for 1A
- 1.23V enables extended MCB performance range
- All power generation is local to expansion board
- (near U800) High speed expansion notes:
- Connects to 2x AD9286 or ISLA118P50 500MSPS 8-bit ADCs
- 8 LVDS pairs + clock in; LVDS[A,B] for OR; LVDSC for clockout
- SPI CLK,DIO,CS for config (use local inverter to generate 2x CS)
- 19 digital I/O total -- 3 for SPI leaves 16 for LA use
- DDC_SDA/DDC_SCL for I2C config use
- Badly matched F_DX*: F_DX14, F_DX17, F_DX18 - use for SPI
- Rest are matched to within 500 mil
- label pins on silk
- UIM_PWR is open-drain pulldown
- FPGA_RESET_N
- APOPTOSIS
- TAMPER, !RESETBMCU
- SN74AUP1T97 is configured as NOR-gate, B-input inverted
- When apoptosis is high, resetting the FPGA resets the CPU
- Apoptosis is normally pulled down, so if unconfigured,
- apoptosis is effectively inactive
- Setting apoptosis creates a one-way 'trap', such that
- the FPGA can only be configured once after boot
- * WDOG_RST output from CPU is also provided
- May be necessary to tie that to apoptosis
- So a crash/watchdog reset forces apoptosis?
- Copyright 2014 Andrew "bunnie" Huang
- Novena PVT2-A
- Copyrights: CC-BY-SA 3.0
- Patents: Apache 2.0
- (in symbol Si4435DY) P
- (in symbol XC6SLX9-2CSG324C, part A) BANK 0
- (in symbol XC6SLX9-2CSG324C, part B) BANK 1
- (in symbol XC6SLX9-2CSG324C, part C) BANK 2
- (in symbol XC6SLX9-2CSG324C, part D) BANK 3

### Library data of the parts
C10F C11F C12F C13F C14F C15F C16F C17F C18F C19F C20F C21F C22F C23F C24F C25F C26F C27F C28F C29F C30F C31F C32F C33F C34F C35F C36F C37F C38F C39F C40F C41F C42F C43F C44F C45F C46F C47F C48F C49F C50F C51F C52F C53F C54F C55F C56F C57F C58F C59F C60F C61F C62F C63F C65F C66F C67F C68F C69F C70F C71F C72F C73F C74F C76F C77F C78F C79F C80F C81F C82F C83F C84F C85F C86F C87F C88F C89F C90F C91F C92F C93F C94F C95F = Cap Semi: Capacitor (Semiconductor SIM Model); Published: 8-Jun-2000; LatestRevisionDate: 17-Jul-2002; LatestRevisionNote: Re-released for DXP Platform.; PackageReference: C1206; Publisher: Altium Limited
D11F = D Schottky: Schottky Diode; Code - JEDEC: DO-214-AA; Published: 8-Jun-2000; Publisher: Altium Limited; Revision: July-2002: Re-released for DXP Platform.
D12F = LED2: Typical RED, GREEN, YELLOW, AMBER GaAs LED; Published: 8-Jun-2000; LatestRevisionDate: 17-Jul-2002; LatestRevisionNote: Re-released for DXP Platform.; PackageVersion: Feb-2002; PackageReference: 3.2X1.6X1.1; Publisher: Altium Limited
JP10F = HEADER_HRS_FX10A_80: 80-pin 10Gbps 5mm mated height board-to-board connector
L10F = Inductor Iron: Magnetic-Core Inductor; Published: 24-Mar-1999; LatestRevisionDate: 17-Jul-2002; LatestRevisionNote: Re-released for DXP Platform.; PackageReference: AXIAL-0.9; Publisher: Altium Limited
P10F = Header 6: Header, 6-Pin; LatestRevisionDate: 17-Jul-2002; LatestRevisionNote: Re-released for DXP Platform.; Publisher: Altium Limited
Q10F Q12F = MOSFET-N: N-Channel MOSFET; Published: 8-Jun-2000; LatestRevisionDate: 17-Jul-2002; LatestRevisionNote: Re-released for DXP Platform.; PackageVersion: 1995/1996; PackageReference: E3; Publisher: Altium Limited
Q11F = Si4435DY: Singre P-channel FET, 8A, 30V
R10F R11F R12F R13F R14F R15F R16F R17F R18F R19F R20F R21F R22F R23F R24F R25F R26F R27F R28F R29F R31F R32F R33F R34F R35F R36F = Res1: Resistor; Value: 100k; Published: 8-Jun-2000; LatestRevisionDate: 17-Jul-2002; LatestRevisionNote: Re-released for DXP Platform.; PackageReference: AXIAL-0.3; Publisher: Altium Limited
R30F = Res1: Resistor; Published: 8-Jun-2000; LatestRevisionDate: 17-Jul-2002; LatestRevisionNote: Re-released for DXP Platform.; PackageReference: AXIAL-0.3; Publisher: Altium Limited; Value: 100k
U10F = LMR10515XSD: NatSemi 1.5A step-down regulator in LLP
U11F = SN74AUP1T98DBV: Single-supply voltage translator, multiple logic function
U12F = MT41J128M16HA-125: 2Gb DDR3-1600 SDRAM, 128Mb x 16, 1.25ns, 1.5V, 0 to 95 degC, 96-Ball FBGA, Pb-Free; Manufacturer: Micron; CL: CL = 11; Clock Rate: 800 MHz; Op. Temp.: 0C to +95C; DatasheetVersion: Rev. P; PackageVersion: Rev.E; PackageReference: MICT-HA-96; PackageDescription: 96-Ball Fine-Pitch Ball Grid Array, 14 x 9 mm, Pitch 0.8 mm; Cycle Time: 1.25ns; Data Rate: DDR3-1600; Density: 2Gb; Depth: 128Mb; Package: FBGA; Pin Count: 96-ball; RoHS: Yes; Voltage: 1.5V; Width: x16; Mounting Technology: Surface Mount; PartNumber: MT41J128M16HA-125; ComponentLink1Description: Manufacturer URL; ComponentLink1URL: http://www.micron.com/; ComponentLink2Description: Datasheet; ComponentLink2URL: http://www.micron.com/~/media/Documents/Products/Data%20Sheet/DRAM/2Gb_DDR3_SDRAM.pdf; ComponentLink3Description: Package Specification; ComponentLink3URL: http://www.micron.com/~/media/Documents/Products/Data%20Sheet/DRAM/4Gb_1_35V_DDR3L.pdf
U800 = XC6SLX9-2CSG324C: Spartan-6 LX 1.2V FPGA, 200 User I/Os, 324-Ball Chip-Scale BGA (0.8mm Pitch), Speed Grade 2, Commercial Grade, Pb-Free; FirstPublished: 17-Nov-2009; DatasheetVersion: ver1.3, Nov-2009; PackageVersion: ver1.0, Jun-2009; PackageReference: CSG324; Publisher: Altium Limited; PackageDescription: 324-Ball Chip-Scale BGA (CSG324) Package, 0.8 mm Pitch; Code_JEDEC: MO-275-KKAC-1; ComponentLink1Description: Spartan-6 Datasheet; ComponentLink1URL: http://www.xilinx.com/support/documentation/data_sheets/ds160.pdf; ComponentLink2Description: Pinout Specification; ComponentLink2URL: http://www.xilinx.com/support/documentation/user_guides/ug385.pdf; ComponentLink3Description: CSG324 Package Drawing; ComponentLink3URL: http://www.xilinx.com/support/documentation/package_specs/csg324.pdf; ComponentLink4Description: Spartan-6 Documents; ComponentLink4URL: http://www.xilinx.com/support/documentation/spartan-6.htm; ComponentLink5Description: Xilinx.com Home; ComponentLink5URL: http://www.xilinx.com

## Sheet 16gpio_misc.SchDoc
size B
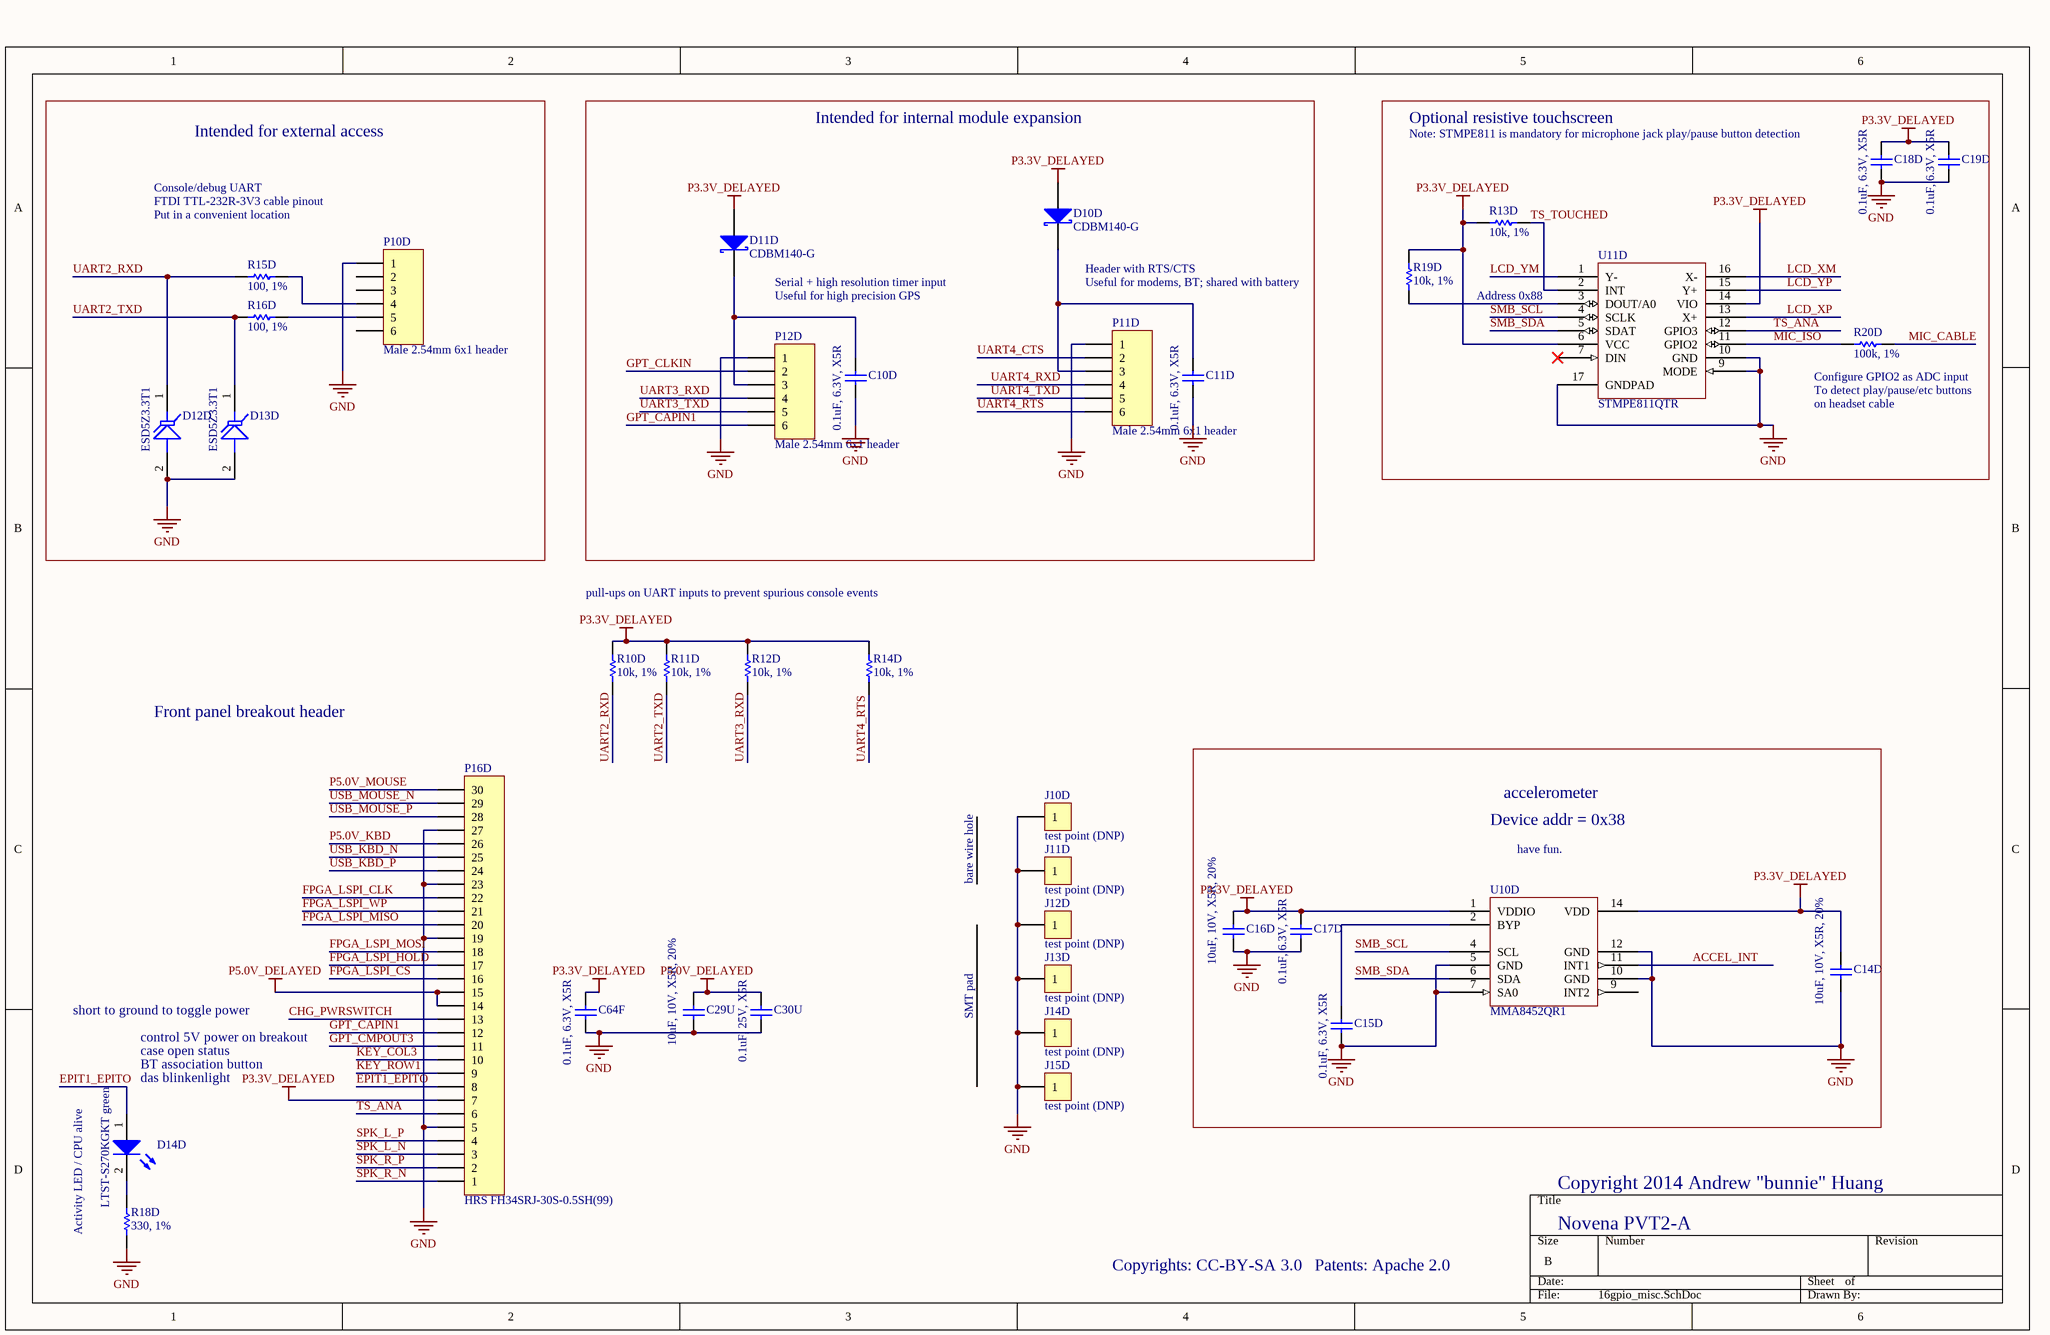
[diagram p18: 16gpio_misc.SchDoc]

### Parts
C10D  0.1uF, 6.3V, X5R  [CAPC0603N_B]
C11D  0.1uF, 6.3V, X5R  [CAPC0603N_B]
C14D  10uF, 10V, X5R, 20%  [CAPC1608N]
C15D  0.1uF, 6.3V, X5R  [CAPC0603N_B]
C16D  10uF, 10V, X5R, 20%  [CAPC1608N]
C17D  0.1uF, 6.3V, X5R  [CAPC0603N_B]
C18D  0.1uF, 6.3V, X5R  [CAPC0603N_B]
C19D  0.1uF, 6.3V, X5R  [CAPC0603N_B]
C29U  10uF, 10V, X5R, 20%  [CAPC1608N]
C30U  0.1uF, 25V, X5R  [CAPC1005N]
C64F  0.1uF, 6.3V, X5R  [CAPC0603N_B]
D10D  CDBM140-G  [SOD123]
D11D  CDBM140-G  [SOD123]
D12D  ESD5Z3.3T1  [SOD-523]
D13D  ESD5Z3.3T1  [SOD-523]
D14D  LTST-S270KGKT green  [CD1608-0603]
J10D  test point (DNP)  [TP_HOLE]
J11D  test point (DNP)  [TP_HOLE]
J12D  test point (DNP)  [TP_SMT_38mil]
J13D  test point (DNP)  [TP_SMT_38mil]
J14D  test point (DNP)  [TP_SMT_38mil]
J15D  test point (DNP)  [TP_SMT_38mil]
P10D  Male 2.54mm 6x1 header  [HDR1X6]
P11D  Male 2.54mm 6x1 header  [HDR1X6]
P12D  Male 2.54mm 6x1 header  [HDR1X6]
P16D  HRS FH34SRJ-30S-0.5SH(99)  [HRS_FH34SRJ-30S-0.5SH]
R10D  10k, 1%  [RESC1005N]
R11D  10k, 1%  [RESC1005N]
R12D  10k, 1%  [RESC1005N]
R13D  10k, 1%  [RESC1005N]
R14D  10k, 1%  [RESC1005N]
R15D  100, 1%  [RESC1005N]
R16D  100, 1%  [RESC1005N]
R18D  330, 1%  [RESC1005N]
R19D  10k, 1%  [RESC1005N]
R20D  100k, 1%  [RESC1005N]
U10D  MMA8452QR1  [FSC_QFN_3x3x1_16_2077-02]
U11D  STMPE811QTR  [QFN50P300X300-16V2N]

### Blocks framed on the sheet
Intended for external access: D12D D13D P10D R15D R16D
Intended for internal module expansion: C10D C11D D10D D11D P11D P12D
Optional resistive touchscreen: C18D C19D R13D R19D R20D U11D

### Nets
GND: C10D.2 C11D.2 C14D.2 C15D.2 C16D.2 C17D.2 C18D.2 C19D.2 C29U.2 C30U.2 C64F.2 D12D.2(A) D13D.2(A) J10D.1 J11D.1 J12D.1 J13D.1 J14D.1 J15D.1 P10D.1 P11D.1 P12D.1 P16D.5 P16D.19 P16D.23 P16D.27 R18D.1 U10D.5(GND) U10D.7(SA0) U10D.10(GND) U10D.12(GND) U11D.9(MODE) U11D.10(GND) U11D.17(GNDPAD)
P3.3V_DELAYED: C14D.1 C16D.1 C17D.1 C18D.1 C19D.1 C64F.1 D10D.1(A) D11D.1(A) P16D.7 R10D.1 R11D.1 R12D.1 R13D.2 R14D.1 R19D.1 U10D.1(VDDIO) U10D.14(VDD) U11D.6(VCC) U11D.14(VIO)
P5.0V_DELAYED: C29U.1 C30U.1 P16D.14 P16D.15
ACCEL_INT: U10D.11(INT1)
CHG_PWRSWITCH: P16D.13
EPIT1_EPITO: D14D.1(A) P16D.8
FPGA_LSPI_CLK: P16D.22
FPGA_LSPI_CS: P16D.16
FPGA_LSPI_HOLD: P16D.17
FPGA_LSPI_MISO: P16D.20
FPGA_LSPI_MOSI: P16D.18
FPGA_LSPI_WP: P16D.21
GPT_CAPIN1: P12D.6 P16D.12
GPT_CLKIN: P12D.2
GPT_CMPOUT3: P16D.11
KEY_COL3: P16D.10
KEY_ROW1: P16D.9
LCD_XM: U11D.16(X-)
LCD_XP: U11D.13(X+)
LCD_YM: U11D.1(Y-)
LCD_YP: U11D.15(Y+)
MIC_CABLE: R20D.2
MIC_ISO: R20D.1 U11D.11(GPIO2)
P5.0V_KBD: P16D.26
P5.0V_MOUSE: P16D.30
SMB_SCL: U10D.4(SCL) U11D.4(SCLK)
SMB_SDA: U10D.6(SDA) U11D.5(SDAT)
SPK_L_N: P16D.3
SPK_L_P: P16D.4
SPK_R_N: P16D.1
SPK_R_P: P16D.2
TS_ANA: P16D.6 U11D.12(GPIO3)
TS_TOUCHED: R13D.1 U11D.2(INT)
UART2_RXD: D12D.1(K) R10D.2 R15D.2
UART2_TXD: D13D.1(K) R11D.2 R16D.2
UART3_RXD: P12D.4 R12D.2
UART3_TXD: P12D.5
UART4_CTS: P11D.2
UART4_RTS: P11D.6 R14D.2
UART4_RXD: P11D.4
UART4_TXD: P11D.5
USB_KBD_N: P16D.25
USB_KBD_P: P16D.24
USB_MOUSE_N: P16D.29
USB_MOUSE_P: P16D.28
NetC10D_1: C10D.1 D11D.2(K) P12D.3
NetC11D_1: C11D.1 D10D.2(K) P11D.3
NetC15D_1: C15D.1 U10D.2(BYP)
NetD14D_2: D14D.2(K) R18D.2
NetP10D_4: P10D.4 R15D.1
NetP10D_5: P10D.5 R16D.1
NetR19D_2: R19D.2 U11D.3(DOUT/A0)

Not connected (* = marked no-connect by the designer): P10D 2 3 6; U10D 9(INT2); U11D 7(DIN)*

### Notes on the sheet
- (near C18D) Note: STMPE811 is mandatory for microphone jack play/pause button detection
- FTDI TTL-232R-3V3 cable pinout
- Console/debug UART
- Put in a convenient location
- Header with RTS/CTS
- Serial + high resolution timer input
- Useful for high precision GPS
- Useful for modems, BT; shared with battery
- Address 0x88
- (near R20D) Configure GPIO2 as ADC input
- (near R20D) To detect play/pause/etc buttons
- on headset cable
- pull-ups on UART inputs to prevent spurious console events
- Front panel breakout header
- accelerometer
- bare wire hole
- Device addr = 0x38
- have fun.
- short to ground to toggle power
- SMT pad
- das blinkenlight
- BT association button
- case open status
- control 5V power on breakout
- Copyright 2014 Andrew "bunnie" Huang
- Activity LED / CPU alive
- Copyrights: CC-BY-SA 3.0
- Patents: Apache 2.0
- Novena PVT2-A

### Library data of the parts
C10D C11D C14D C15D C16D C17D C18D C19D C29U C30U C64F = Cap Semi: Capacitor (Semiconductor SIM Model); Published: 8-Jun-2000; LatestRevisionDate: 17-Jul-2002; LatestRevisionNote: Re-released for DXP Platform.; PackageReference: C1206; Publisher: Altium Limited
D10D D11D = D Schottky: Schottky Diode; Code - JEDEC: DO-214-AA; Published: 8-Jun-2000; Publisher: Altium Limited; Revision: July-2002: Re-released for DXP Platform.
D12D D13D = Tranzorb: On Semi 3.3V standoff TVS diode; Published: 24-Mar-1999; LatestRevisionDate: 17-Jul-2002; LatestRevisionNote: Re-released for DXP Platform.; PackageReference: DO-7; Publisher: Altium Limited
D14D = LED2: Green R/A LED, 0603 package; Published: 8-Jun-2000; LatestRevisionDate: 17-Jul-2002; LatestRevisionNote: Re-released for DXP Platform.; PackageVersion: Feb-2002; PackageReference: 3.2X1.6X1.1; Publisher: Altium Limited
J10D J11D J12D J13D J14D J15D = CON1: Connector
P10D P11D P12D = Header 6: Header, 6-Pin; LatestRevisionDate: 17-Jul-2002; LatestRevisionNote: Re-released for DXP Platform.; Publisher: Altium Limited
P16D = Header 30: Header, 30-Pin; LatestRevisionDate: 17-Jul-2002; LatestRevisionNote: Re-released for DXP Platform.; Publisher: Altium Limited
R10D R11D R12D R13D R14D R15D R16D R18D R19D = Res1: Resistor; Value: 100k; Published: 8-Jun-2000; LatestRevisionDate: 17-Jul-2002; LatestRevisionNote: Re-released for DXP Platform.; PackageReference: AXIAL-0.3; Publisher: Altium Limited
R20D = Res1: Resistor; Published: 8-Jun-2000; LatestRevisionDate: 17-Jul-2002; LatestRevisionNote: Re-released for DXP Platform.; PackageReference: AXIAL-0.3; Publisher: Altium Limited; Value: 100k
U10D = MMA8452QR1: 3-axis, 12-bit/8-bit digital accelerometer
U11D = STMPE610: 4-wire resistive touchscreen controller

## Nets that join several sheets
GND: 02cpu_power (190 pins), 03cpu_sodimm (104 pins), 04pwr_pmic (61 pins), 05pwr_input (61 pins), 06cpu_soc (40 pins), 07sdcard (19 pins), 08usb (81 pins), 09sata (19 pins), 10ethernet100 (47 pins), 11ethernetGbit (38 pins), 12mPCIe (32 pins), 13hdmi_lcd (49 pins), 14audio (39 pins), 15fpga (184 pins), 16gpio_misc (34 pins)
P0.75V_REFDDR: 03cpu_sodimm (10 pins), 04pwr_pmic (C19P.1 U200.31), 15fpga (R10F.1)
P1.5V_DDR_SW3: 03cpu_sodimm (64 pins), 04pwr_pmic (8 pins), 15fpga (52 pins)
P1.5V_VGEN2: 04pwr_pmic (C11P.1 U200.18), 12mPCIe (5 pins)
P1.8V_SW4: 03cpu_sodimm (R16M.1), 04pwr_pmic (C42P.1 L13P.2 U200.19)
P1.8V_VGEN3: 04pwr_pmic (C12P.1 U200.26), 14audio (R24A.2)
P2.5V_VGEN5: 02cpu_power (8 pins), 04pwr_pmic (C15P.1 U200.39), 05pwr_input (Q11N.1), 07sdcard (R21S.2), 11ethernetGbit (9 pins)
P2.8V_VGEN6: 04pwr_pmic (C16P.1 U200.41), 05pwr_input (Q13N.1)
P3.0V_STBY: 02cpu_power (C71C.1 D10C.2 U100.G11), 04pwr_pmic (C24P.1 R11P.2 R13P.2 U200.43)
P3.0V_VDDHIGH_SW2: 02cpu_power (5 pins), 04pwr_pmic (6 pins)
P3.3V: 04pwr_pmic (33 pins), 05pwr_input (10 pins), 06cpu_soc (5 pins), 13hdmi_lcd (5 pins)
P3.3V_DELAYED: 02cpu_power (20 pins), 03cpu_sodimm (C17M.1 JP10M.199 R12M.1), 04pwr_pmic (C17P.1 R14P.2 U200.27), 05pwr_input (6 pins), 06cpu_soc (13 pins), 07sdcard (9 pins), 08usb (25 pins), 09sata (7 pins), 10ethernet100 (14 pins), 11ethernetGbit (6 pins), 12mPCIe (7 pins), 13hdmi_lcd (8 pins), 14audio (6 pins), 15fpga (73 pins), 16gpio_misc (19 pins)
P5.0V: 03cpu_sodimm (R13M.1), 05pwr_input (22 pins)
P5.0V_DELAYED: 05pwr_input (Q10N.5 Q10N.6 Q10N.7 Q10N.8), 08usb (10 pins), 09sata (5 pins), 10ethernet100 (R10E.1), 11ethernetGbit (C29G.1 U11G.4 U11G.5), 13hdmi_lcd (5 pins), 14audio (C18A.2 C27A.2 U10A.6 U12A.6), 15fpga (9 pins), 16gpio_misc (C29U.1 C30U.1 P16D.14 P16D.15)
P5.0V_SWBST: 04pwr_pmic (C49P.1 D11P.2 U200.44), 08usb (R25U.2)
VCC_1.2V_SW1AB: 02cpu_power (32 pins), 04pwr_pmic (6 pins)
VDD_HIGH_CAP: 02cpu_power (8 pins), 09sata (C20H.1 C21H.1 U100.G12), 12mPCIe (C27X.1 C28X.1 U100.G7), 13hdmi_lcd (5 pins)
VDD_SOC_IN_SW1C: 02cpu_power (20 pins), 04pwr_pmic (C40P.1 C41P.1 L12P.1 U200.13)
VDDSOC_CAP: 02cpu_power (18 pins), 09sata (C15H.1 C16H.1 U100.G13), 12mPCIe (C19X.1 C20X.1 L10X.1 U100.H7), 13hdmi_lcd (C20L.1 C21L.1 U100.L7)
ACCEL_INT: 13hdmi_lcd (U100.V25), 16gpio_misc (U10D.11)
AUD6_TFS: 13hdmi_lcd (U100.N20), 15fpga (U800.A4)
AUD6_TXC: 13hdmi_lcd (U100.N21), 15fpga (U800.B4)
AUD6_TXD: 13hdmi_lcd (U100.N25), 15fpga (U800.A6)
AUD_ALRCK: 13hdmi_lcd (U100.M3), 14audio (U11A.9)
AUD_CLK: 13hdmi_lcd (R10L.2), 14audio (U11A.5)
AUD_DIN: 13hdmi_lcd (U100.N3), 14audio (U11A.8)
AUD_DOUT: 13hdmi_lcd (U100.P2), 14audio (U11A.6)
AUD_HP_IN: 13hdmi_lcd (U100.T20), 14audio (C34A.2 R16A.2)
AUD_LRCLK: 13hdmi_lcd (U100.N4), 14audio (U11A.7)
AUD_MCLK: 07sdcard (R16S.1), 13hdmi_lcd (R26L.2), 14audio (R29A.1 R32A.2 U11A.1), 15fpga (U800.H6)
AUD_PWRON: 13hdmi_lcd (U100.W24), 14audio (Q10A.1 R19A.1 R30A.1)
BATT_NRST: 05pwr_input (D16N.1 R22N.2), 13hdmi_lcd (U100.N2), 15fpga (U800.N1)
BATT_PWR: 05pwr_input (17 pins), 13hdmi_lcd (5 pins)
BATT_REFLASH_ALRT: 13hdmi_lcd (J11L.1 U100.P3), 15fpga (U800.N2)
CEC: 06cpu_soc (U100.H19), 13hdmi_lcd (D10L.1 D10L.10 R31L.2 U100.K2)
CHG_PWRSWITCH: 05pwr_input (R39N.2), 16gpio_misc (P16D.13)
CLK2_N: 06cpu_soc (R57B.2 U100.C5), 15fpga (U800.H1)
CLK2_P: 06cpu_soc (R57B.1 U100.D5), 15fpga (U800.H2)
CPU_TAMPER: 06cpu_soc (P_TAMPER.2 R28B.2 U100.E11), 15fpga (R26F.2)
DDC_SCL: 04pwr_pmic (U200.54), 06cpu_soc (U100.E22), 13hdmi_lcd (Q15L.1 R20L.2), 15fpga (JP10F.B3 U800.J6)
DDC_SDA: 04pwr_pmic (U200.53), 06cpu_soc (U100.C25), 13hdmi_lcd (Q16L.2 R23L.2), 15fpga (JP10F.A5 U800.F2)
ECSPI3_MISO: 13hdmi_lcd (U100.P23), 15fpga (U800.A3)
ECSPI3_MOSI: 13hdmi_lcd (U100.P22), 15fpga (U800.A2 U800.R13)
ECSPI3_RDY: 13hdmi_lcd (U100.R24), 15fpga (U800.A5)
ECSPI3_SCLK: 13hdmi_lcd (U100.P24), 15fpga (U800.D9 U800.R15)
ECSPI3_SS2: 13hdmi_lcd (U100.R25), 15fpga (U800.B3)
EIM_A16: 06cpu_soc (U100.H25), 15fpga (U800.A11)
EIM_A17: 06cpu_soc (U100.G24), 15fpga (U800.B12)
EIM_A18: 06cpu_soc (U100.J22), 15fpga (U800.D14)
EIM_BCLK: 06cpu_soc (U100.N22), 15fpga (U800.C9)
EIM_CS0: 06cpu_soc (U100.H24), 15fpga (U800.B11)
EIM_CS1: 06cpu_soc (U100.J23), 15fpga (U800.A15)
EIM_DA0: 06cpu_soc (R50B.1 U100.L20), 15fpga (U800.G9)
EIM_DA1: 06cpu_soc (R37B.1 U100.J25), 15fpga (U800.A10)
EIM_DA2: 06cpu_soc (R49B.1 U100.L21), 15fpga (U800.F9)
EIM_DA3: 06cpu_soc (R48B.1 U100.K24), 15fpga (U800.B9)
EIM_DA4: 06cpu_soc (R36B.2 R47B.1 U100.L22), 15fpga (U800.E13)
EIM_DA5: 06cpu_soc (R38B.1 U100.L23), 15fpga (U800.F13)
EIM_DA6: 06cpu_soc (R40B.1 U100.K25), 15fpga (U800.A9)
EIM_DA7: 06cpu_soc (R46B.1 U100.L25), 15fpga (U800.A8)
EIM_DA8: 06cpu_soc (R55B.1 U100.L24), 15fpga (U800.B8)
EIM_DA9: 06cpu_soc (R54B.1 U100.M21), 15fpga (U800.D8)
EIM_DA10: 06cpu_soc (R53B.1 U100.M22), 15fpga (U800.D11)
EIM_DA11: 06cpu_soc (R42B.1 U100.M20), 15fpga (U800.C8)
EIM_DA12: 06cpu_soc (R44B.1 U100.M24), 15fpga (U800.C7)
EIM_DA13: 06cpu_soc (R35B.2 U100.M23), 15fpga (U800.C11)
EIM_DA14: 06cpu_soc (R52B.1 U100.N23), 15fpga (U800.C4)
EIM_DA15: 06cpu_soc (R51B.1 U100.N24), 15fpga (U800.B6)
EIM_LBA: 06cpu_soc (U100.K22), 15fpga (U800.B14)
EIM_OE: 06cpu_soc (U100.J24), 15fpga (U800.C10)
EIM_RW: 06cpu_soc (U100.K20), 15fpga (U800.C14)
EIM_WAIT: 06cpu_soc (U100.M25), 15fpga (U800.A7)
EPIT1_EPITO: 06cpu_soc (U100.G21), 16gpio_misc (D14D.1 P16D.8)
FPGA_DONE: 13hdmi_lcd (U100.T24), 15fpga (R22F.1 U800.V17)
FPGA_EXP_ON: 07sdcard (U100.C20), 15fpga (Q12F.1 R36F.2)
FPGA_INIT_N: 13hdmi_lcd (U100.T23), 15fpga (R21F.2 U800.U3)
FPGA_LSPI_CLK: 15fpga (U800.D3), 16gpio_misc (P16D.22)
FPGA_LSPI_CS: 15fpga (U800.D1), 16gpio_misc (P16D.16)
FPGA_LSPI_HOLD: 15fpga (U800.E3), 16gpio_misc (P16D.17)
FPGA_LSPI_MISO: 15fpga (U800.D2), 16gpio_misc (P16D.20)
FPGA_LSPI_MOSI: 15fpga (U800.C2), 16gpio_misc (P16D.18)
FPGA_LSPI_WP: 15fpga (U800.C1), 16gpio_misc (P16D.21)
FPGA_RESET_N: 13hdmi_lcd (U100.R20), 15fpga (R25F.1 U11F.6 U800.V2)
FPGA_SUSPEND: 13hdmi_lcd (U100.R21), 15fpga (R23F.2 U800.R16)
FPGA_TCK: 13hdmi_lcd (U100.U25), 15fpga (P10F.2 U800.A17)
FPGA_TDI: 13hdmi_lcd (U100.T22), 15fpga (P10F.3 U800.D15)
FPGA_TDO: 13hdmi_lcd (U100.T21), 15fpga (P10F.4 U800.D16)
FPGA_TMS: 13hdmi_lcd (U100.U24), 15fpga (P10F.5 U800.B18)
GPT_CAPIN1: 07sdcard (U100.A21), 16gpio_misc (P12D.6 P16D.12)
GPT_CLKIN: 07sdcard (U100.D20), 16gpio_misc (P12D.2)
GPT_CMPOUT3: 07sdcard (U100.F18), 16gpio_misc (P16D.11)
HDMI_HPD_CPU: 06cpu_soc (U100.F25), 13hdmi_lcd (R27L.1 R28L.1 U100.K1)
I2C3_SCL: 06cpu_soc (U100.F21), 07sdcard (U10S.6), 13hdmi_lcd (JP10L.7), 14audio (R26A.2), 15fpga (U800.P4)
I2C3_SDA: 06cpu_soc (U100.D24), 07sdcard (U10S.5), 13hdmi_lcd (JP10L.8), 14audio (R27A.2), 15fpga (U800.P3)
KEY_COL3: 07sdcard (U100.U5), 16gpio_misc (P16D.10)
KEY_ROW1: 07sdcard (U100.U6), 14audio (R28A.1), 16gpio_misc (P16D.9)
LCD_BL_ON: 07sdcard (U100.V5), 13hdmi_lcd (JP10L.6)
LCD_XM: 13hdmi_lcd (JP10L.3), 16gpio_misc (U11D.16)
LCD_XP: 13hdmi_lcd (JP10L.1), 16gpio_misc (U11D.13)
LCD_YM: 13hdmi_lcd (JP10L.4), 16gpio_misc (U11D.1)
LCD_YP: 13hdmi_lcd (JP10L.2), 16gpio_misc (U11D.15)
MIC_CABLE: 14audio (5 pins), 16gpio_misc (R20D.2)
OTG_ID: 07sdcard (U100.W23), 08usb (D15U.1 R41U.1 R42U.1)
P5.0V_KBD: 08usb (C52U.1 U16U.5), 16gpio_misc (P16D.26)
P5.0V_MOUSE: 08usb (C51U.1 U15U.5), 16gpio_misc (P16D.30)
PCIE_CLKREQ_N: 12mPCIe (JP10X.7 R23X.1), 13hdmi_lcd (U100.U22)
PCIE_PWRON: 07sdcard (U100.R1), 12mPCIe (Q10X.1 R11X.1)
PCIE_REFCLK_N: 06cpu_soc (U100.C7), 12mPCIe (C17X.2)
PCIE_REFCLK_P: 06cpu_soc (U100.D7), 12mPCIe (C18X.2)
PCIE_RST: 06cpu_soc (U100.J19), 12mPCIe (JP10X.22 R16X.2)
PCIE_WAKE: 06cpu_soc (U100.E23), 12mPCIe (J10X.1 JP10X.1)
PCIE_WDIS_N: 06cpu_soc (U100.F24), 12mPCIe (JP10X.20)
PMIC_INT_B: 04pwr_pmic (R14P.1 U200.1), 13hdmi_lcd (U100.V24)
PMIC_ON_REQ: 04pwr_pmic (R12P.2), 06cpu_soc (U100.D11)
PMIC_STBY_REQ: 04pwr_pmic (U200.4), 06cpu_soc (U100.F11)
RESETBMCU: 04pwr_pmic (U200.3), 05pwr_input (U13N.A1 U14N.2), 06cpu_soc (6 pins), 08usb (R23U.2 R44U.2), 15fpga (Q10F.3 U800.F1)
RGMII_INT: 07sdcard (U100.P5 U100.V21), 11ethernetGbit (R11G.1 U10G.38)
RGMII_MDC: 07sdcard (U100.V20), 11ethernetGbit (U10G.36)
RGMII_MDIO: 07sdcard (U100.V23), 11ethernetGbit (R13G.1 U10G.37)
RGMII_NRST: 06cpu_soc (U100.D25), 11ethernetGbit (R20G.2 U10G.42)
RGMII_REF_CLK: 07sdcard (R20S.1 R21S.1 U100.V22), 11ethernetGbit (R21G.2)
SATA_PWRON: 06cpu_soc (U100.J20), 09sata (Q11H.1 R12H.2)
SMB_SCL: 03cpu_sodimm (JP10M.202), 04pwr_pmic (U10P.6), 05pwr_input (D15N.1 R21N.1), 06cpu_soc (U100.H20), 12mPCIe (JP10X.30 R21X.1), 13hdmi_lcd (U100.N5), 15fpga (U800.N3), 16gpio_misc (U10D.4 U11D.4)
SMB_SDA: 03cpu_sodimm (JP10M.200), 04pwr_pmic (U10P.5), 05pwr_input (D17N.1 R23N.2), 06cpu_soc (U100.G23), 12mPCIe (JP10X.32 R22X.1), 13hdmi_lcd (U100.N6), 15fpga (U800.N4), 16gpio_misc (U10D.6 U11D.5)
SPK_L_N: 14audio (P10A.1 U10A.8), 16gpio_misc (P16D.3)
SPK_L_P: 14audio (P10A.2 R10A.1 U10A.5), 16gpio_misc (P16D.4)
SPK_R_N: 14audio (P11A.1 U12A.8), 16gpio_misc (P16D.1)
SPK_R_P: 14audio (P11A.2 R13A.1 U12A.5), 16gpio_misc (P16D.2)
TS_TOUCHED: 13hdmi_lcd (U100.U23), 16gpio_misc (R13D.1 U11D.2)
UART2_RXD: 06cpu_soc (U100.E25), 16gpio_misc (D12D.1 R10D.2 R15D.2)
UART2_TXD: 06cpu_soc (U100.E24), 16gpio_misc (D13D.1 R11D.2 R16D.2)
UART3_RXD: 06cpu_soc (U100.G22), 16gpio_misc (P12D.4 R12D.2)
UART3_TXD: 06cpu_soc (U100.F22), 16gpio_misc (P12D.5)
UART4_CTS: 13hdmi_lcd (U100.L3), 15fpga (U800.U1), 16gpio_misc (P11D.2)
UART4_RTS: 13hdmi_lcd (U100.L4), 15fpga (U800.U2), 16gpio_misc (P11D.6 R14D.2)
UART4_RXD: 05pwr_input (D13N.1 R27N.2 R30N.2), 07sdcard (U100.V6), 13hdmi_lcd (U100.L1), 15fpga (U800.T1), 16gpio_misc (P11D.4)
UART4_TXD: 05pwr_input (D14N.1 R26N.2 R28N.2), 07sdcard (U100.W5), 13hdmi_lcd (U100.M2), 15fpga (U800.P1), 16gpio_misc (P11D.5)
UIM_CLK: 06cpu_soc (U100.H22), 12mPCIe (JP10X.12 U10X.C3), 15fpga (U800.B16)
UIM_DATA: 06cpu_soc (U100.G25), 12mPCIe (JP10X.10 U10X.C7), 15fpga (U800.A12)
UIM_PWR: 12mPCIe (C16X.1 JP10X.8 Q12X.3 U10X.C1), 15fpga (U800.C18)
UIM_PWRON: 06cpu_soc (U100.J21), 12mPCIe (Q12X.1 R14X.2), 15fpga (U800.A14)
UIM_RESET: 06cpu_soc (U100.H23), 12mPCIe (JP10X.14 U10X.C2), 15fpga (U800.C15)
USB_ETH_N: 08usb (U10U.9), 10ethernet100 (R11E.1)
USB_ETH_P: 08usb (U10U.10), 10ethernet100 (R13E.1)
USB_HUB1_RST: 08usb (R26U.2 R27U.2), 13hdmi_lcd (U100.P25), 15fpga (U800.C5)
USB_HUB2_RST: 08usb (R45U.2 R46U.2), 13hdmi_lcd (U100.R23), 15fpga (U800.G3)
USB_KBD_N: 08usb (U13U.17), 16gpio_misc (P16D.25)
USB_KBD_P: 08usb (U13U.18), 16gpio_misc (P16D.24)
USB_MOUSE_N: 08usb (U13U.9), 16gpio_misc (P16D.29)
USB_MOUSE_P: 08usb (U13U.10), 16gpio_misc (P16D.28)
USB_OVERCUR5_N: 08usb (U13U.42), 13hdmi_lcd (R12L.1 U10L.3)
USB_PCI_N: 08usb (U10U.17), 12mPCIe (JP10X.36)
USB_PCI_P: 08usb (U10U.18), 12mPCIe (JP10X.38)
USB_PWREN5_N: 08usb (U13U.43), 13hdmi_lcd (U10L.1)
USB_VID_N: 08usb (U13U.21), 13hdmi_lcd (JP10L.47)
USB_VID_P: 08usb (U13U.22), 13hdmi_lcd (JP10L.48)